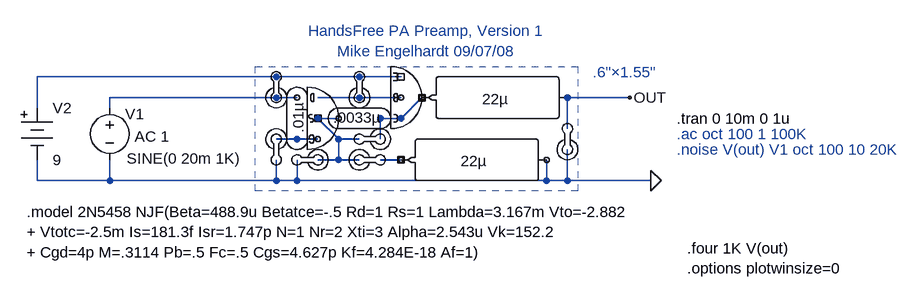
[diagram p0: schematic HandsFreeLayout.asc]
HandsFreeLayout.asc, the LTspice schematic file:
Version 4
SHEET 1 1440 764
WIRE -128 -128 -496 -128
WIRE 0 -128 -128 -128
WIRE 64 -128 0 -128
WIRE -128 -96 -384 -96
WIRE -96 -96 -128 -96
WIRE 0 -96 -64 -96
WIRE 64 -96 0 -96
WIRE 416 -96 320 -96
WIRE -496 -80 -496 -128
WIRE -384 -80 -384 -96
WIRE -32 -64 -64 -64
WIRE 64 -64 96 -96
WIRE 64 -64 32 -64
WIRE 320 -48 320 -96
WIRE -96 -32 -128 -32
WIRE -64 -32 -96 -32
WIRE -32 -32 -64 -64
WIRE 0 -32 -32 -32
WIRE 32 -32 32 -64
WIRE -32 0 -32 -32
WIRE -32 0 -64 0
WIRE 0 0 -32 0
WIRE 64 0 32 0
WIRE -496 32 -496 0
WIRE -384 32 -384 0
WIRE -384 32 -496 32
WIRE -128 32 -128 0
WIRE -128 32 -384 32
WIRE -96 32 -96 0
WIRE -96 32 -128 32
WIRE 288 32 288 0
WIRE 288 32 -96 32
WIRE 320 32 320 -16
WIRE 320 32 288 32
WIRE 448 32 320 32
FLAG 448 32 0
FLAG 416 -96 OUT
SYMBOL 2N5458 -64 -64 R180
WINDOW 0 9 -58 Invisible 2
SYMATTR InstName Q1
SYMBOL 2N3906 64 -96 R180
WINDOW 0 9 -58 Invisible 2
SYMATTR InstName Q2
SYMBOL SMcap -96 -64 R180
WINDOW 0 0 0 Invisible 2
WINDOW 3 -2 1 VCenter 2
SYMATTR InstName C1
SYMATTR Value .01µ
SYMBOL SMcap 0 -64 R90
WINDOW 0 -1 0 Invisible 2
WINDOW 3 -1 3 VCenter 2
SYMATTR InstName C2
SYMATTR Value .0033µ
SYMBOL coaxCap7 208 -96 M90
WINDOW 0 -2 -1 Invisible 2
WINDOW 3 2 1 VCenter 2
SYMATTR InstName C3
SYMATTR Value 22µ
SYMBOL coaxCap7 176 0 M90
WINDOW 0 11 -7 Invisible 2
WINDOW 3 2 0 VCenter 2
SYMATTR InstName C4
SYMATTR Value 22µ
SYMBOL RN55upright -128 -96 R0
WINDOW 0 -18 -30 Invisible 2
SYMATTR InstName R1
SYMATTR Value 10K
SYMBOL RN55upright 0 -96 R0
WINDOW 0 -18 -30 Invisible 2
SYMATTR InstName R2
SYMATTR Value 5K
SYMBOL RN55upright -128 -32 R180
WINDOW 0 -18 -30 Invisible 2
SYMATTR InstName R3
SYMATTR Value 1Meg
SYMBOL RN55upright -64 0 R270
WINDOW 0 16 -16 Invisible 2
SYMATTR InstName R4
SYMATTR Value 1.6K
SYMBOL RN55upright 32 -32 M90
WINDOW 0 -16 -16 Invisible 2
SYMATTR InstName R5
SYMATTR Value 4K
SYMBOL RN55upright 0 0 R90
WINDOW 0 -16 -16 Invisible 2
SYMATTR InstName R6
SYMATTR Value 200
SYMBOL voltage -384 -96 R0
WINDOW 3 26 94 Left 2
WINDOW 123 38 60 Left 2
WINDOW 39 0 0 Left 2
WINDOW 0 24 25 Left 2
SYMATTR Value SINE(0 20m 1K)
SYMATTR Value2 AC 1
SYMATTR InstName V1
SYMBOL misc\\battery -496 -96 R0
WINDOW 123 21 97 Left 2
WINDOW 39 39 88 Left 2
SYMATTR Value 9
SYMATTR InstName V2
SYMBOL RN55upright 320 -16 R0
WINDOW 0 -18 -30 Invisible 2
SYMATTR InstName R7
SYMATTR Value 27K
TEXT 488 -64 Left 2 !.tran 0 10m 0 1u
TEXT 408 -120 Bottom 2 ;.6"×1.55"
TEXT 104 -152 Bottom 2 ;HandsFree PA Preamp, Version 1\nMike Engelhardt 09/07/08
TEXT -512 80 Left 2 !.model 2N5458 NJF(Beta=488.9u Betatce=-.5 Rd=1 Rs=1 Lambda=3.167m Vto=-2.882\n+ Vtotc=-2.5m Is=181.3f Isr=1.747p N=1 Nr=2 Xti=3 Alpha=2.543u Vk=152.2\n+ Cgd=4p M=.3114 Pb=.5 Fc=.5 Cgs=4.627p Kf=4.284E-18 Af=1)
TEXT 504 136 Left 2 !.four 1K V(out)\n.options plotwinsize=0
TEXT 488 -40 Left 2 ;.ac oct 100 1 100K
TEXT 488 -16 Left 2 ;.noise V(out) V1 oct 100 10 20K
RECTANGLE Normal 336 48 -160 -144 2

The netlist it stands for:
* HandsFreeLayout.asc
J§Q1 N003 N006 N004 2N5458
Q2 N005 N003 N001 0 2N3906
C1 N006 N002 .01µ
C2 N005 N004 .0033µ
C3 N005 OUT 22µ
C4 N007 0 22µ
R1 N001 N002 10K
R2 N001 N003 5K
R3 0 N006 1Meg
R4 0 N004 1.6K
R5 N004 N005 4K
R6 N007 N004 200
V1 N002 0 SINE(0 20m 1K) AC 1
V2 N001 0 9
R7 OUT 0 27K
.model NPN NPN
.model PNP PNP
.lib standard.bjt
.model NJF NJF
.model PJF PJF
.lib standard.jft
.tran 0 10m 0 1u
* .6"×1.55"
* HandsFree PA Preamp, Version 1
* Mike Engelhardt 09/07/08
.model 2N5458 NJF(Beta=488.9u Betatce=-.5 Rd=1 Rs=1 Lambda=3.167m Vto=-2.882
+ Vtotc=-2.5m Is=181.3f Isr=1.747p N=1 Nr=2 Xti=3 Alpha=2.543u Vk=152.2
+ Cgd=4p M=.3114 Pb=.5 Fc=.5 Cgs=4.627p Kf=4.284E-18 Af=1)
.four 1K V(out)
.options plotwinsize=0
* .ac oct 100 1 100K
* .noise V(out) V1 oct 100 10 20K
.backanno
.end